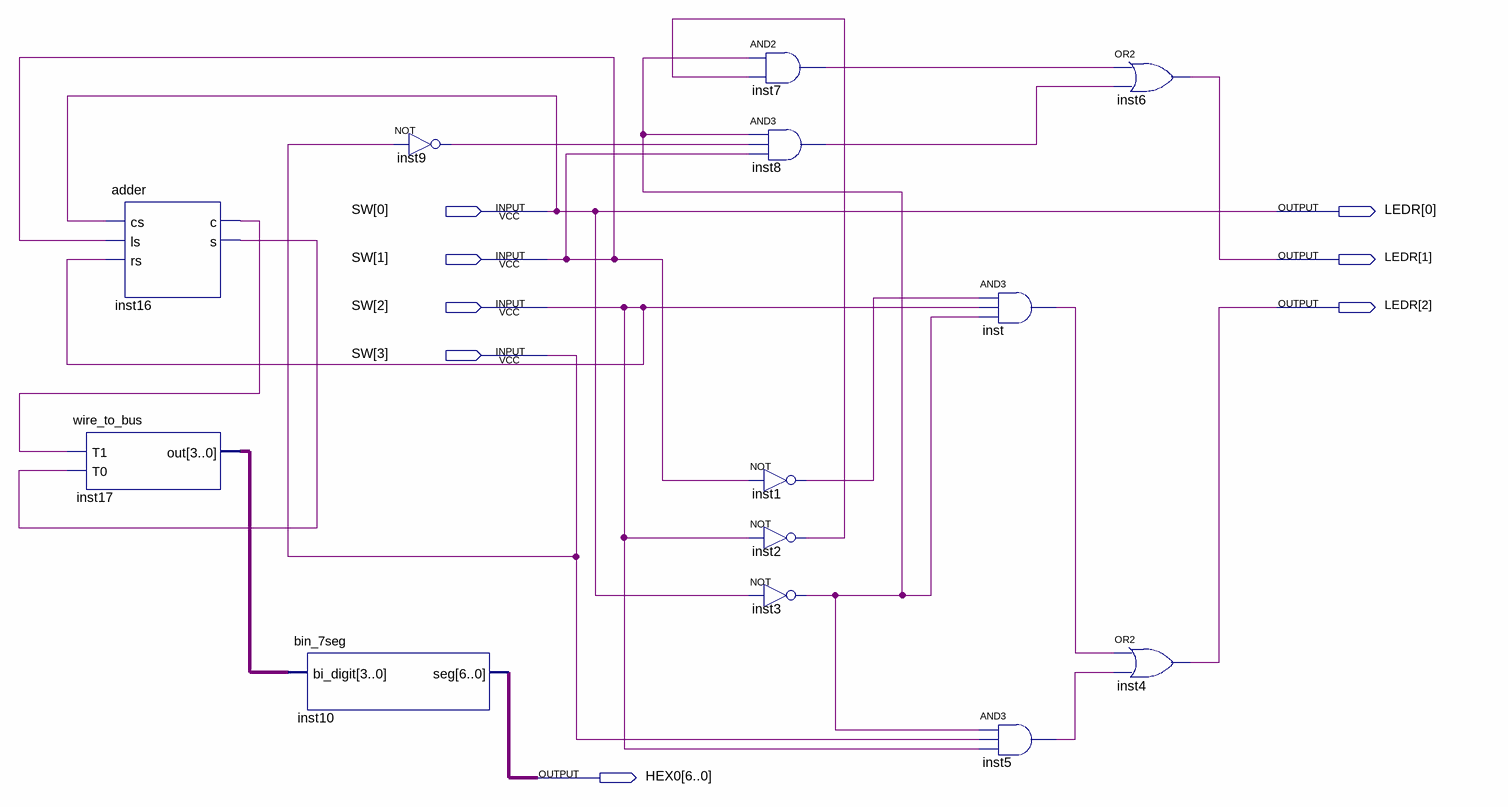
[diagram p0: schematic sheet]
// Quartus schematic lab3.bdf as structural Verilog: 13 symbols, 8 pins
module lab3 (
  input  [3:0] SW,
  output [2:0] LEDR,
  output [6:0] HEX0
);

  wire inst1_out, inst2_out, inst3_out, inst5_out, inst7_out, inst8_out, inst9_out, inst16_c, inst16_s,
       inst_out;
  wire [3:0] inst17_out;

  adder inst16 (.cs(SW[0]), .ls(SW[1]), .rs(SW[2]), .c(inst16_c), .s(inst16_s));
  wire_to_bus inst17 (.T1(inst16_c), .T0(inst16_s), .out(inst17_out));
  bin_7seg inst10 (.bi_digit(inst17_out), .seg(HEX0));
  not inst9 (inst9_out, SW[3]);
  and inst7 (inst7_out, inst3_out, inst2_out);
  and inst8 (inst8_out, inst3_out, inst9_out, SW[1]);
  not inst1 (inst1_out, SW[1]);
  not inst2 (inst2_out, SW[2]);
  not inst3 (inst3_out, SW[0]);
  and inst (inst_out, inst1_out, SW[2], inst3_out);
  and inst5 (inst5_out, inst3_out, SW[3], SW[2]);
  or inst6 (LEDR[1], inst7_out, inst8_out);
  or inst4 (LEDR[2], inst_out, inst5_out);

  assign LEDR[0] = SW[0];
endmodule
